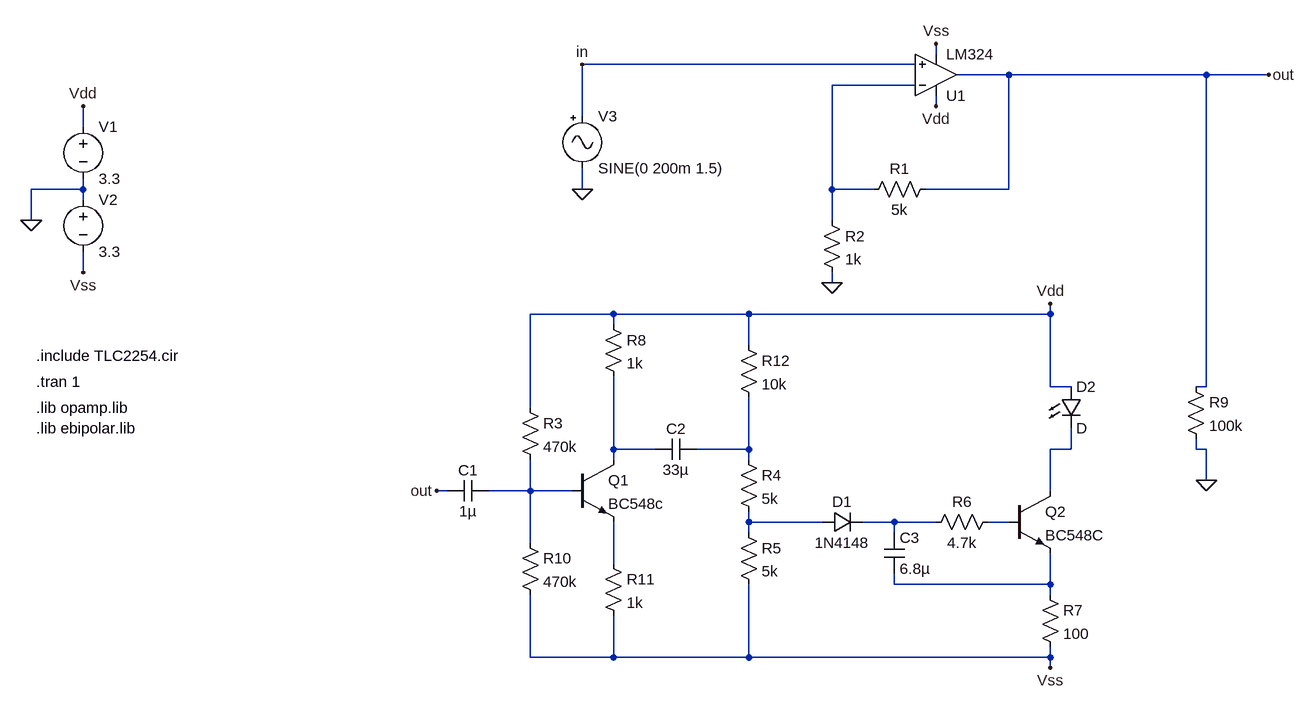
[diagram p0: schematic agc_ldr.asc]
agc_ldr.asc, the LTspice schematic file:
Version 4
SHEET 1 1456 1104
WIRE 864 32 864 16
WIRE 832 48 320 48
WIRE 976 64 896 64
WIRE 1280 64 976 64
WIRE 1376 64 1280 64
WIRE 832 80 704 80
WIRE 864 112 864 96
WIRE 320 128 320 48
WIRE -448 144 -448 112
WIRE -448 240 -448 224
WIRE -448 240 -528 240
WIRE 320 240 320 208
WIRE 704 240 704 80
WIRE 768 240 704 240
WIRE 976 240 976 64
WIRE 976 240 848 240
WIRE -448 256 -448 240
WIRE -528 288 -528 240
WIRE 704 288 704 240
WIRE -448 368 -448 336
WIRE 704 384 704 368
WIRE 368 432 240 432
WIRE 576 432 368 432
WIRE 1040 432 1040 416
WIRE 1040 432 576 432
WIRE 368 448 368 432
WIRE 576 480 576 432
WIRE 1040 544 1040 432
WIRE 1072 544 1040 544
WIRE 1280 544 1280 64
WIRE 1280 544 1264 544
WIRE 240 576 240 432
WIRE 368 640 368 528
WIRE 432 640 368 640
WIRE 576 640 576 560
WIRE 576 640 496 640
WIRE 1072 640 1072 608
WIRE 1072 640 1040 640
WIRE 1264 640 1264 624
WIRE 1280 640 1264 640
WIRE 368 656 368 640
WIRE 576 656 576 640
WIRE 1280 688 1280 640
WIRE 112 704 96 704
WIRE 240 704 240 656
WIRE 240 704 176 704
WIRE 304 704 240 704
WIRE 1040 704 1040 640
WIRE 576 752 576 736
WIRE 688 752 576 752
WIRE 800 752 752 752
WIRE 864 752 800 752
WIRE 976 752 944 752
WIRE 576 768 576 752
WIRE 800 768 800 752
WIRE 240 784 240 704
WIRE 368 816 368 752
WIRE 800 848 800 832
WIRE 1040 848 1040 800
WIRE 1040 848 800 848
WIRE 1040 864 1040 848
WIRE 240 960 240 864
WIRE 368 960 368 896
WIRE 368 960 240 960
WIRE 576 960 576 848
WIRE 576 960 368 960
WIRE 1040 960 1040 944
WIRE 1040 960 576 960
WIRE 1040 976 1040 960
FLAG -528 288 0
FLAG -448 112 Vdd
FLAG 864 112 Vdd
FLAG 864 16 Vss
FLAG -448 368 Vss
FLAG 320 240 0
FLAG 1376 64 out
FLAG 320 48 in
FLAG 704 384 0
FLAG 1280 688 0
FLAG 1040 416 Vdd
FLAG 96 704 out
FLAG 1040 976 Vss
SYMBOL voltage -448 128 R0
SYMATTR InstName V1
SYMATTR Value 3.3
SYMBOL voltage -448 240 R0
SYMATTR InstName V2
SYMATTR Value 3.3
SYMBOL Misc\\signal 320 112 R0
WINDOW 123 24 144 Left 2
WINDOW 39 0 0 Left 2
SYMATTR InstName V3
SYMATTR Value SINE(0 200m 1.5)
SYMBOL res 864 224 R90
WINDOW 0 0 56 VBottom 2
WINDOW 3 32 56 VTop 2
SYMATTR InstName R1
SYMATTR Value 5k
SYMBOL cap 112 720 R270
WINDOW 0 32 32 VTop 2
WINDOW 3 0 32 VBottom 2
SYMATTR InstName C1
SYMATTR Value 1µ
SYMBOL res 688 272 R0
SYMATTR InstName R2
SYMATTR Value 1k
SYMBOL npn 304 656 R0
SYMATTR InstName Q1
SYMATTR Value BC548c
SYMBOL res 224 560 R0
SYMATTR InstName R3
SYMATTR Value 470k
SYMBOL cap 496 624 R90
WINDOW 0 0 32 VBottom 2
WINDOW 3 32 32 VTop 2
SYMATTR InstName C2
SYMATTR Value 33µ
SYMBOL res 560 640 R0
SYMATTR InstName R4
SYMATTR Value 5k
SYMBOL res 560 752 R0
SYMATTR InstName R5
SYMATTR Value 5k
SYMBOL diode 688 768 R270
WINDOW 0 32 32 VTop 2
WINDOW 3 0 32 VBottom 2
SYMATTR InstName D1
SYMATTR Value 1N4148
SYMBOL cap 784 768 R0
SYMATTR InstName C3
SYMATTR Value 6.8µ
SYMBOL res 960 736 R90
WINDOW 0 0 56 VBottom 2
WINDOW 3 32 56 VTop 2
SYMATTR InstName R6
SYMATTR Value 4.7k
SYMBOL npn 976 704 R0
SYMATTR InstName Q2
SYMATTR Value BC548C
SYMBOL res 1024 848 R0
SYMATTR InstName R7
SYMATTR Value 100
SYMBOL res 352 432 R0
SYMATTR InstName R8
SYMATTR Value 1k
SYMBOL Opamps\\opamp2 864 128 M180
SYMATTR InstName U1
SYMATTR Value LM324
SYMATTR SpiceModel LM324
SYMBOL res 1248 528 R0
SYMATTR InstName R9
SYMATTR Value 100k
SYMBOL LED 1056 544 R0
SYMATTR InstName D2
SYMBOL res 224 768 R0
SYMATTR InstName R10
SYMATTR Value 470k
SYMBOL res 352 800 R0
SYMATTR InstName R11
SYMATTR Value 1k
SYMBOL res 560 464 R0
SYMATTR InstName R12
SYMATTR Value 10k
TEXT -520 536 Left 2 !.tran 1
TEXT -520 496 Left 2 !.include TLC2254.cir
TEXT -520 576 Left 2 !.lib opamp.lib
TEXT -520 608 Left 2 !.lib ebipolar.lib

The netlist it stands for:
* agc_ldr.asc
V1 Vdd 0 3.3
V2 0 Vss 3.3
V3 in 0 SINE(0 200m 1.5)
R1 out N001 5k
C1 out N005 1µ
R2 N001 0 1k
Q1 N002 N005 N009 0 BC548c
R3 Vdd N005 470k
C2 N003 N002 33µ
R4 N003 N006 5k
R5 N006 Vss 5k
D1 N006 N007 1N4148
C3 N007 N010 6.8µ
R6 N008 N007 4.7k
Q2 N004 N008 N010 0 BC548C
R7 N010 Vss 100
R8 Vdd N002 1k
XU1 in N001 Vdd Vss out LM324 LM324  ; pins In+ In- V+ V- OUT
R9 out 0 100k
D2 Vdd N004 D
R10 N005 Vss 470k
R11 N009 Vss 1k
R12 Vdd N003 10k
.model D D
.lib standard.dio
.model NPN NPN
.model PNP PNP
.lib standard.bjt
.tran 1
.include TLC2254.cir
.lib opamp.lib
.lib ebipolar.lib
.backanno
.end